# EAGLE design stackduino (EAGLE 5.07)
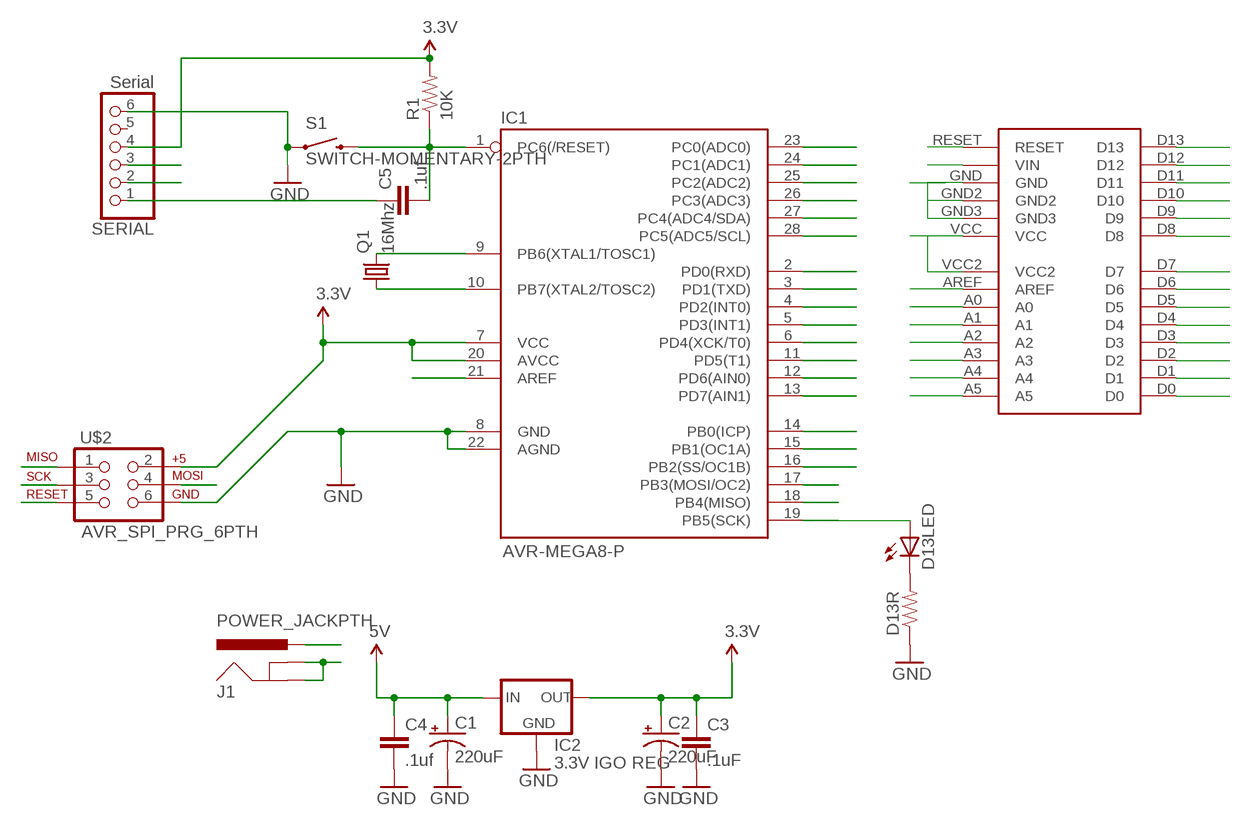
[diagram p0: schematic, sheet 1]

## Parts
C1  220uF  CAP_POLPTH1  [CPOL-RADIAL-100UF-25V]
C2  220uF  CAP_POLPTH1  [CPOL-RADIAL-100UF-25V]
C3  .1uF  CAP0805  [0805]
C4  .1uf  CAP0805  [0805]
C5  .1uf  CAP0805  [0805]
D13LED  LED1206  [LED-1206]
D13R  RESISTOR  [0805]
IC1  AVR-MEGA8-P  [DIL28-3]
IC2  3.3V IGO REG  V_REG_78XXSINK  [TO220-IGO]
J1  POWER_JACKPTH  [POWER_JACK_PTH]
Q1  16Mhz  CRYSTALHC49US  [HC49US]
R1  10K  RESISTOR  [0805]
S1  SWITCH-MOMENTARY-2PTH  [TACTILE-PTH]
SERIAL  Serial  PINHD-1X6  [1X06]
U$2  AVR_SPI_PRG_6PTH  [2X3]
U$3  STACKDUINO_HEADERS  [STACKDUINO_HEADERS]

## Nets
3.3V: C2.1(+) C3.1 IC1.7(VCC) IC1.20(AVCC) IC2.OUT R1.2 SERIAL.4 U$2.2 U$3.VCC U$3.VCC2
5V: C1.1(+) C4.1 IC2.IN J1.PWR U$3.VIN
A0: IC1.23(PC0(ADC0)) U$3.A0
A1: IC1.24(PC1(ADC1)) U$3.A1
A2: IC1.25(PC2(ADC2)) U$3.A2
A3: IC1.26(PC3(ADC3)) U$3.A3
A4: IC1.27(PC4(ADC4/SDA)) U$3.A4
A5: IC1.28(PC5(ADC5/SCL)) U$3.A5
AREF: IC1.21(AREF) U$3.AREF
D2: IC1.4(PD2(INT0)) U$3.D2
D3: IC1.5(PD3(INT1)) U$3.D3
D4: IC1.6(PD4(XCK/T0)) U$3.D4
D5: IC1.11(PD5(T1)) U$3.D5
D6: IC1.12(PD6(AIN0)) U$3.D6
D7: IC1.13(PD7(AIN1)) U$3.D7
D8: IC1.14(PB0(ICP)) U$3.D8
D9: IC1.15(PB1(OC1A)) U$3.D9
D10: IC1.16(PB2(SS/OC1B)) U$3.D10
D11: IC1.17(PB3(MOSI/OC2)) U$2.4 U$3.D11
D12: IC1.18(PB4(MISO)) U$2.1 U$3.D12
D13: D13LED.A IC1.19(PB5(SCK)) U$2.3 U$3.D13
GND: C1.2(-) C2.2(-) C3.2 C4.2 D13R.1 IC1.8(GND) IC1.22(AGND) IC2.GND J1.GND J1.GNDBREAK S1.1 SERIAL.6 U$2.6 U$3.GND U$3.GND2 U$3.GND3
N$1: C5.1 SERIAL.1
N$2: IC1.9(PB6(XTAL1/TOSC1)) Q1.2
N$3: IC1.10(PB7(XTAL2/TOSC2)) Q1.1
N$4: D13LED.C D13R.2
RESET: C5.2 IC1.1(PC6(/RESET)) R1.1 S1.3 U$2.5 U$3.RESET
RXD: IC1.2(PD0(RXD)) SERIAL.3 U$3.D0
TXD: IC1.3(PD1(TXD)) SERIAL.2 U$3.D1
Unconnected: SERIAL.5

## Library data of the parts
C1 C2 = SparkFun:CAP_POL: Capacitor Polarized These are standard SMD and PTH capacitors. Normally 10uF, 47uF, and 100uF in electrolytic and tantalum varieties. Always verify the external diameter of the through hole cap, it varies with capacity, voltage, and manufacturer. The EIA devices should be standard.
C3-C5 = SparkFun:CAP: Capacitor Standard 0603 ceramic capacitor, and 0.1" leaded capacitor.
D13LED = SparkFun:LED: LEDs Standard schematic elements and footprints for 5mm, 3mm, 1206, and 0603 sized LEDs. 5mm - Spark Fun Electronics SKU : COM-00529 (and others)
D13R R1 = SparkFun:RESISTOR: Resistor Basic schematic elements and footprints for 0603, 1206, and PTH 1/10th watt (small) resistors.
IC1 = SparkFun:AVR-MEGA8-P: MICROCONTROLLER 8 Kbytes FLASH 1 kbytes SRAM 512 bytes EEPROM USART 4-channel 10 bit ADC 2-channel 8 bit ADC
IC2 = SparkFun:V_REG_78XX: Voltage Regulator Standard 7805 5V regulator. IGO (Input Ground Output). Spark Fun Electronics SKU : COM-00107
J1 = SparkFun:POWER_JACK: Power Jack This is the standard 5.5mm barrel jack for power. The PTH is the most common, proven, reliable, footprint. All others are experimental. The Slot footprint only works if the mill layer is transmitted to the PCB fab house so be warned. Spark Fun Electronics SKU : PRT-00119. Mating wall wart : TOL-00298 (and others)
Q1 = SparkFun:CRYSTAL: Crystals Various standard crystals. Proven footprints. Spark Fun Electronics SKU : COM-00534
S1 = SparkFun:SWITCH-MOMENTARY-2
SERIAL = pinhead:PINHD-1X6: PIN HEADER
U$2 = SparkFun:AVR_SPI_PRG_6: AVR ISP 6 Pin This is the reduced ISP connector for AVR programming. Common on Arduino. This footprint will take up less PCB space and can be used with a 10-pin to 6-pin adapter such as SKU: BOB-08508
U$3 = edebill:STACKDUINO_HEADERS

## Net classes
0 GND: width 0.406 mm
1 3.3V: width 0.406 mm
2 5v: width 0.406 mm

## Board
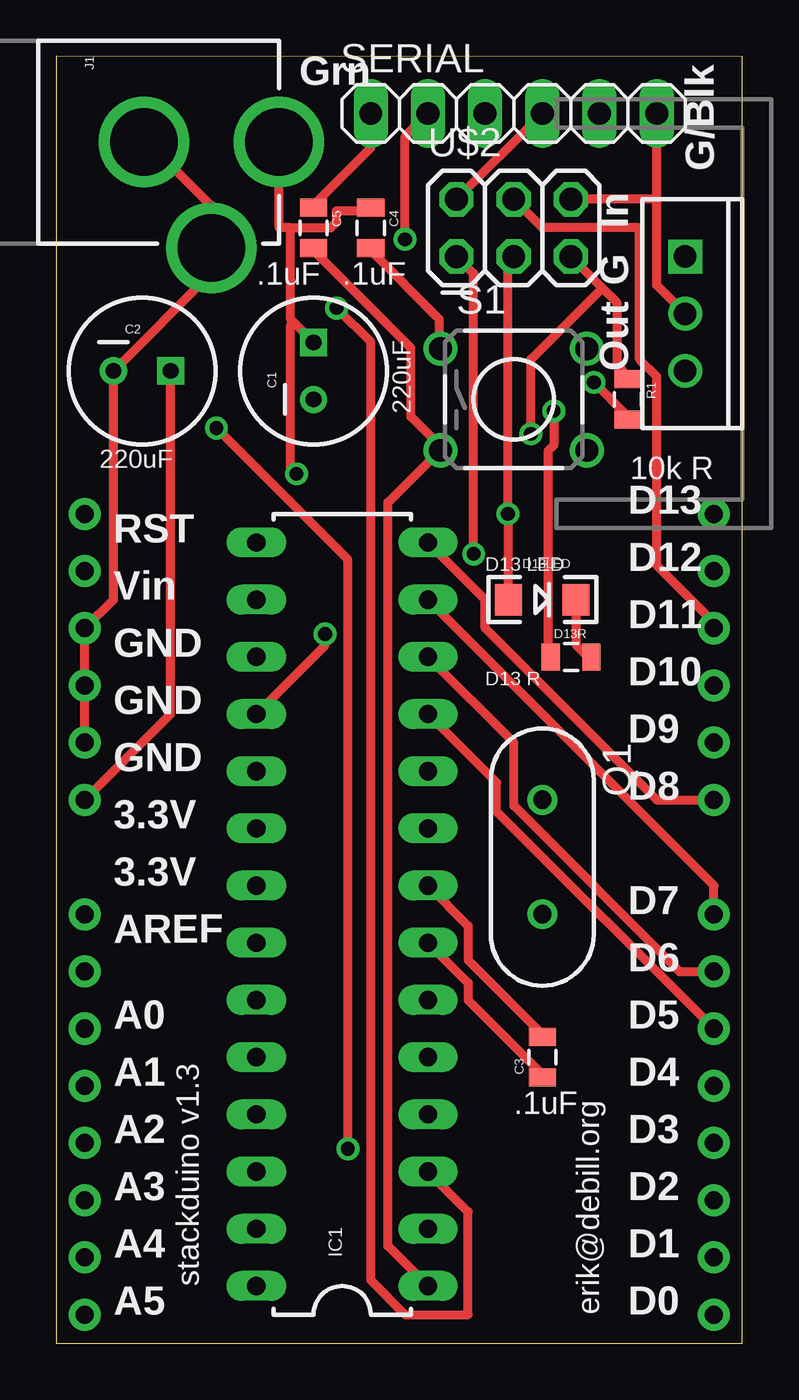
[diagram p1: board, top side]
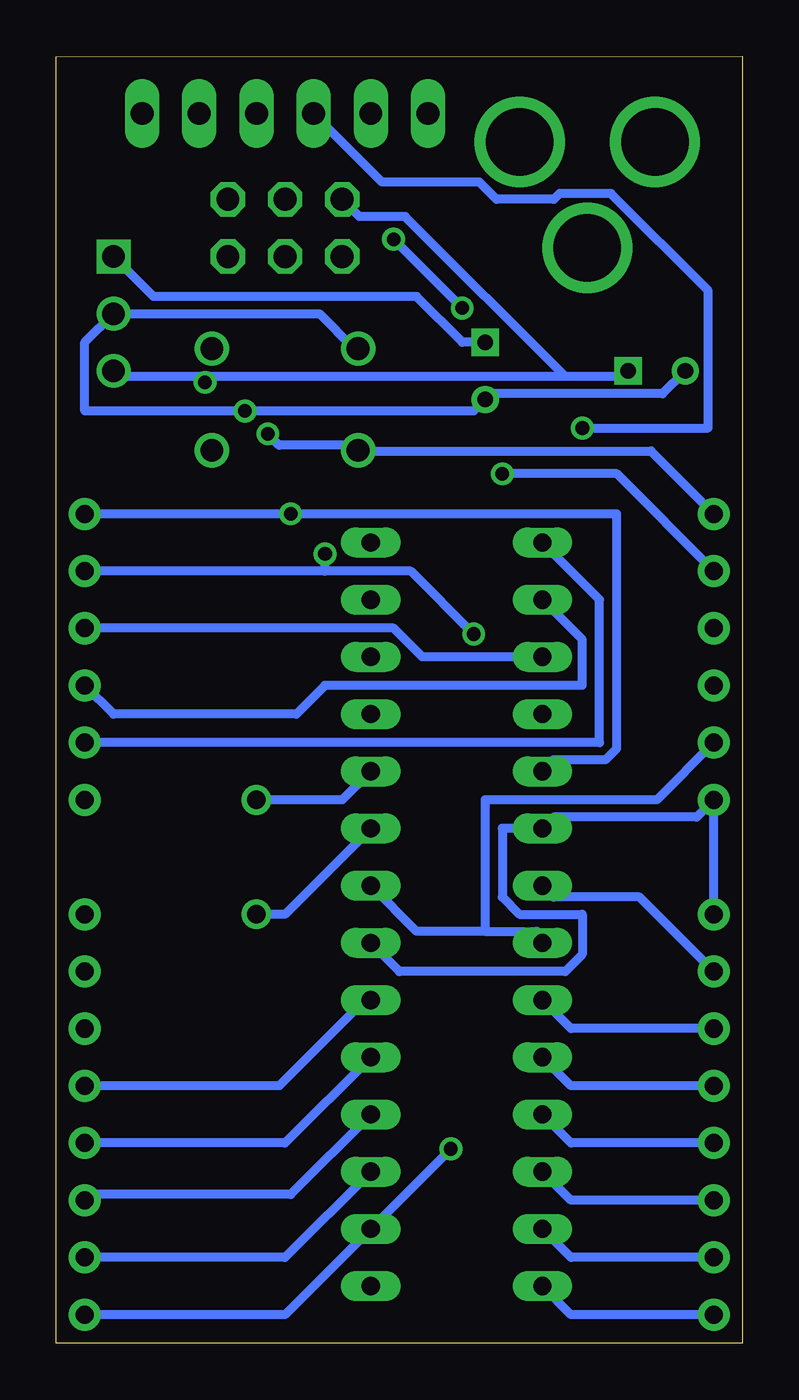
[diagram p2: board, bottom side, seen from below]

Size 30.48 x 57.15 mm. Coordinates in mm from the lower left corner, seen from the top.
Outline: 0,57.15 0,0 30.48,0 30.48,57.14 0,57.15
Copper layers (1*16): Top 0.035mm / dielectric 1.5mm / Bottom 0.035mm
Design rules "default *": minimum track width 8mil, minimum drill 24mil, track to track 8mil, track to pad 8mil, pad to pad 8mil, via to via 8mil, smd to smd 8mil, copper to edge 40mil, drill to drill 8mil, minimum pad ring 10mil, minimum via ring 8mil, stop-mask expansion 4mil, vias tented up to drill 0mil, thermal gap 10mil

### Footprints (pad centres in the part's own frame; a part is rotated, then mirrored left to right if it is on the bottom)
CPOL-RADIAL-100UF-25V = drill 0.7 square: 1 1.27,0 | drill 0.7 round: 2 -1.27,0
0805 = smd 0.8 x 1.2: 1 -0.9,0; 2 0.9,0
LED-1206 = smd 1.2 x 1.4: A -1.5,0; C 1.5,0
DIL28-3 = drill 0.813 long: 1 -16.51,-3.81; 2 -13.97,-3.81; 3 -11.43,-3.81; 4 -8.89,-3.81; 5 -6.35,-3.81; 6 -3.81,-3.81; 7 -1.27,-3.81; 8 1.27,-3.81; 9 3.81,-3.81; 10 6.35,-3.81; 11 8.89,-3.81; 12 11.43,-3.81; 13 13.97,-3.81; 14 16.51,-3.81; 15 16.51,3.81; 16 13.97,3.81; 17 11.43,3.81; 18 8.89,3.81; 19 6.35,3.81; 20 3.81,3.81; 21 1.27,3.81; 22 -1.27,3.81; 23 -3.81,3.81; 24 -6.35,3.81; 25 -8.89,3.81; 26 -11.43,3.81; 27 -13.97,3.81; 28 -16.51,3.81
TO220-IGO = drill 1 round: GND 0,0; OUT 2.54,0 | drill 1 square: IN -2.54,0
POWER_JACK_PTH = drill 2.997 round: GND 0,7.7; GNDBREAK 4.7,10.7; PWR 0,13.7
HC49US = drill 0.813 round: 1 -2.54,0; 2 2.54,0
TACTILE-PTH = drill 1.016 round: 1 -3.251,2.261; 2 3.251,2.261; 3 -3.251,-2.261; 4 3.251,-2.261
1X06 = drill 1.016 long: 1 -6.35,0; 2 -3.81,0; 3 -1.27,0; 4 1.27,0; 5 3.81,0; 6 6.35,0
2X3 = drill 1.016 octagon: 1 0,0; 2 0,2.54; 3 2.54,0; 4 2.54,2.54; 5 5.08,0; 6 5.08,2.54
STACKDUINO_HEADERS = drill 0.8 pad 1.422 round: A0 -13.97,-13.97; A1 -13.97,-16.51; A2 -13.97,-19.05; A3 -13.97,-21.59; A4 -13.97,-24.13; A5 -13.97,-26.67; AREF -13.97,-11.43; D0 13.97,-26.67; D1 13.97,-24.13; D2 13.97,-21.59; D3 13.97,-19.05; D4 13.97,-16.51; D5 13.97,-13.97; D6 13.97,-11.43; D7 13.97,-8.89; D8 13.97,-3.81; D9 13.97,-1.27; D10 13.97,1.27; D11 13.97,3.81; D12 13.97,6.35; D13 13.97,8.89; GND -13.97,3.81; GND2 -13.97,1.27; GND3 -13.97,-1.27; RESET -13.97,8.89; VCC -13.97,-3.81; VCC2 -13.97,-8.89; VIN -13.97,6.35

### Placement (x,y rotation side)
C1  11.43,43.18 90 top
C2  3.81,43.18 0 top
C3  21.59,12.7 90 top
C4  13.97,49.53 270 top
C5  11.43,49.53 270 top
D13LED  21.59,33.02 0 top
D13R  22.86,30.48 0 top
IC1  12.7,19.05 90 top
IC2  27.94,45.72 270 top
J1  -3.81,53.34 270 top
Q1  21.59,21.59 270 top
R1  25.4,41.91 270 top
S1  20.32,41.91 0 top
SERIAL  20.32,54.61 0 top
U$2  17.78,48.26 0 top
U$3  15.24,27.94 0 top

### Tracks (layer width: path | path; a pad name or v marks a point on that pad's centre or on a via)
3.3V  (via drill 0.61)
  Top 0.406: IC1.7 18.29,16 18.29,15.24 21.59,11.94 C3.1 | U$2.2 SERIAL.4 | U$3.VCC 5.08,27.94 C2.1 | v23.88,42.67 25.4,41.15 R1.2
  Bottom 0.406: IC1.7 15.24,16.51 7.87,16.51 7.11,17.27 7.11,19.05 9.91,19.05 10.67,19.81 10.67,22.86 IC1.20 8.38,23.37 2.03,23.37 U$3.VCC U$3.VCC2 | IC2.OUT 27.69,42.93 23.88,42.93 | 7.87,42.93 5.33,42.93 C2.1 | 7.87,42.93 23.88,42.93 | U$2.2 17.02,50.04 14.99,50.04 7.87,42.93 | 23.88,42.93 v23.88,42.67
5V  (via drill 0.61)
  Top 0.406: 10.41,49.53 9.91,49.53 9.91,53.34 J1.PWR | 10.41,49.53 12.19,49.53 12.45,49.78 12.45,50.29 13.97,50.29 C4.1 | 10.54,45.34 10.41,45.47 10.41,49.53 | 10.54,45.34 C1.1 | v10.67,38.61 10.41,38.86 10.41,45.21 10.54,45.34
  Bottom 0.406: U$3.VIN 5.59,38.61 v10.67,38.61 | IC2.IN 26.16,46.48 14.48,46.48 12.45,44.45 C1.1
A0
  Bottom 0.406: IC1.23 7.62,13.97 U$3.A0
A1
  Bottom 0.406: IC1.24 7.62,11.43 U$3.A1
A2
  Bottom 0.406: IC1.25 7.62,8.89 U$3.A2
A3
  Bottom 0.406: IC1.26 7.62,6.35 U$3.A3
A4
  Bottom 0.406: IC1.27 7.62,3.81 U$3.A4
A5
  Bottom 0.406: IC1.28 7.62,1.27 U$3.A5
AREF
  Bottom 0.406: IC1.21 8.38,19.81 4.57,19.81 U$3.AREF
D2
  Bottom 0.406: IC1.4 20.07,6.6 28.96,6.6 U$3.D2
D3
  Bottom 0.406: IC1.5 20.32,8.89 U$3.D3
D4
  Bottom 0.254: IC1.6 16.66,15.24 | U$3.D4 29.06,11.58
  Bottom 0.406: U$3.D4 20.57,11.43 16.76,15.24 IC1.6
D5
  Top 0.406: IC1.11 19.56,24.89 19.56,23.62 U$3.D5
D6
  Top 0.406: IC1.12 20.32,26.67 20.32,23.88 27.69,16.51 U$3.D6
D7
  Top 0.406: IC1.13 29.21,20.32 U$3.D7
D8
  Top 0.406: IC1.14 19.05,33.02 19.05,31.75 26.67,24.13 U$3.D8
D9
  Bottom 0.406: IC1.15 6.35,33.02 6.35,26.67 U$3.D9
D10
  Bottom 0.406: IC1.16 7.11,31.24 7.11,29.21 18.54,29.21 19.81,27.94 27.94,27.94 U$3.D10
D11
  Top 0.406: U$2.4 21.59,49.53 25.91,49.53 25.91,43.69 26.67,42.93 26.67,34.54 29.21,32 U$3.D11
  Bottom 0.406: IC1.17 14.22,30.48 15.49,31.75 U$3.D11
D12  (via drill 0.61)
  Top 0.406: IC1.18 11.94,30.99 v11.94,31.5 | U$2.1 18.54,47.5 v18.54,35.05
  Bottom 0.406: v11.94,31.5 14.73,34.29 18.54,34.29 | 18.54,34.29 U$3.D12 | 18.54,34.29 v18.54,35.05
D13  (via drill 0.61)
  Top 0.406: U$2.3 20.07,48.01 v20.07,36.83 20.07,33.02 D13LED.A
  Bottom 0.406: IC1.19 8.38,25.91 6.1,25.91 5.59,26.42 5.59,36.83 v20.07,36.83 U$3.D13
GND  (via drill 0.61)
  Top 0.406: U$3.GND3 U$3.GND2 U$3.GND 2.54,33.02 C2.2 6.86,47.5 6.86,48.51 J1.GNDBREAK 6.86,48.77 6.86,50.55 4.06,53.34 J1.GND | C4.2 13.97,48.51 17.02,45.47 17.02,44.2 S1.1 | IC2.GND 26.67,46.99 26.67,50.8 | 26.67,50.8 SERIAL.6 | 26.67,50.8 U$2.6 | IC1.8 18.29,18.54 18.29,17.02 21.59,13.72 C3.2 | v22.1,41.4 22.1,39.88 21.84,39.62 21.84,30.48 D13R.1
  Bottom 0.406: 8.94,17.88 IC1.22 8.89,18.03 9.14,18.29 11.43,18.29 | 11.43,18.29 14.48,18.29 IC1.8 | 11.43,18.29 11.43,24.13 3.81,24.13 U$3.GND3 | S1.1 17.27,44.2 18.8,45.72 IC2.GND 29.21,44.45 29.21,41.4 v22.1,41.4 11.94,41.4 C1.2 11.18,42.16 3.56,42.16 C2.2
N$1
  Top 0.406: SERIAL.1 13.97,53.09 11.43,50.55 C5.1
N$2
  Bottom 0.406: IC1.9 20.32,19.05 Q1.2
N$3
  Bottom 0.406: IC1.10 17.78,24.13 Q1.1
N$4
  Top 0.406: D13R.2 23.62,30.48 23.11,30.99 23.11,33.02 D13LED.C
RESET  (via drill 0.61)
  Top 0.406: C5.2 11.43,48.51 15.75,44.2 15.75,41.15 17.02,39.88 S1.3 17.02,39.62 14.73,37.34 14.73,4.32 IC1.1 | 24.26,46.86 U$2.5 | 24.26,46.86 24.89,46.23 24.89,43.43 25.4,42.93 R1.1 | v21.08,40.39 21.08,43.69 24.26,46.86
  Bottom 0.406: U$3.RESET 4.06,39.62 17.02,39.62 S1.3 17.27,39.88 20.57,39.88 v21.08,40.39
RXD  (via drill 0.61)
  Top 0.406: v7.11,40.64 12.95,34.8 v12.95,8.64
  Bottom 0.406: U$3.D0 20.32,1.27 IC1.2 v12.95,8.64 | SERIAL.3 16,51.56 11.68,51.56 10.92,50.8 8.38,50.8 8.13,51.05 5.84,51.05 1.52,46.74 1.52,40.64 v7.11,40.64
TXD  (via drill 0.61)
  Top 0.406: SERIAL.2 15.49,53.59 v15.49,49.02 | v12.45,45.97 13.97,44.45 13.97,2.79 15.49,1.27 18.29,1.27 18.29,5.84 IC1.3
  Bottom 0.406: IC1.3 20.32,3.81 U$3.D1 | v12.45,45.97 v15.49,49.02

### Text on the board
tPlace: Grn | G/Blk | In | .1uF | .1uF | G | Out | 10k R | D13 | RST | D13 LED | D12 | Vin | D11 | GND | D13 R | D10 | GND | D9 | GND | D8 | 3.3V | 3.3V | D7 | AREF | D6 | A0 | D5 | A1 | D4 | .1uF | A2 | D3 | A3 | D2 | A4 | D1 | stackduino v1.3 | A5 | erik@debill.org | D0